# EAGLE design projeto-sd-rtc (EAGLE 5.12)
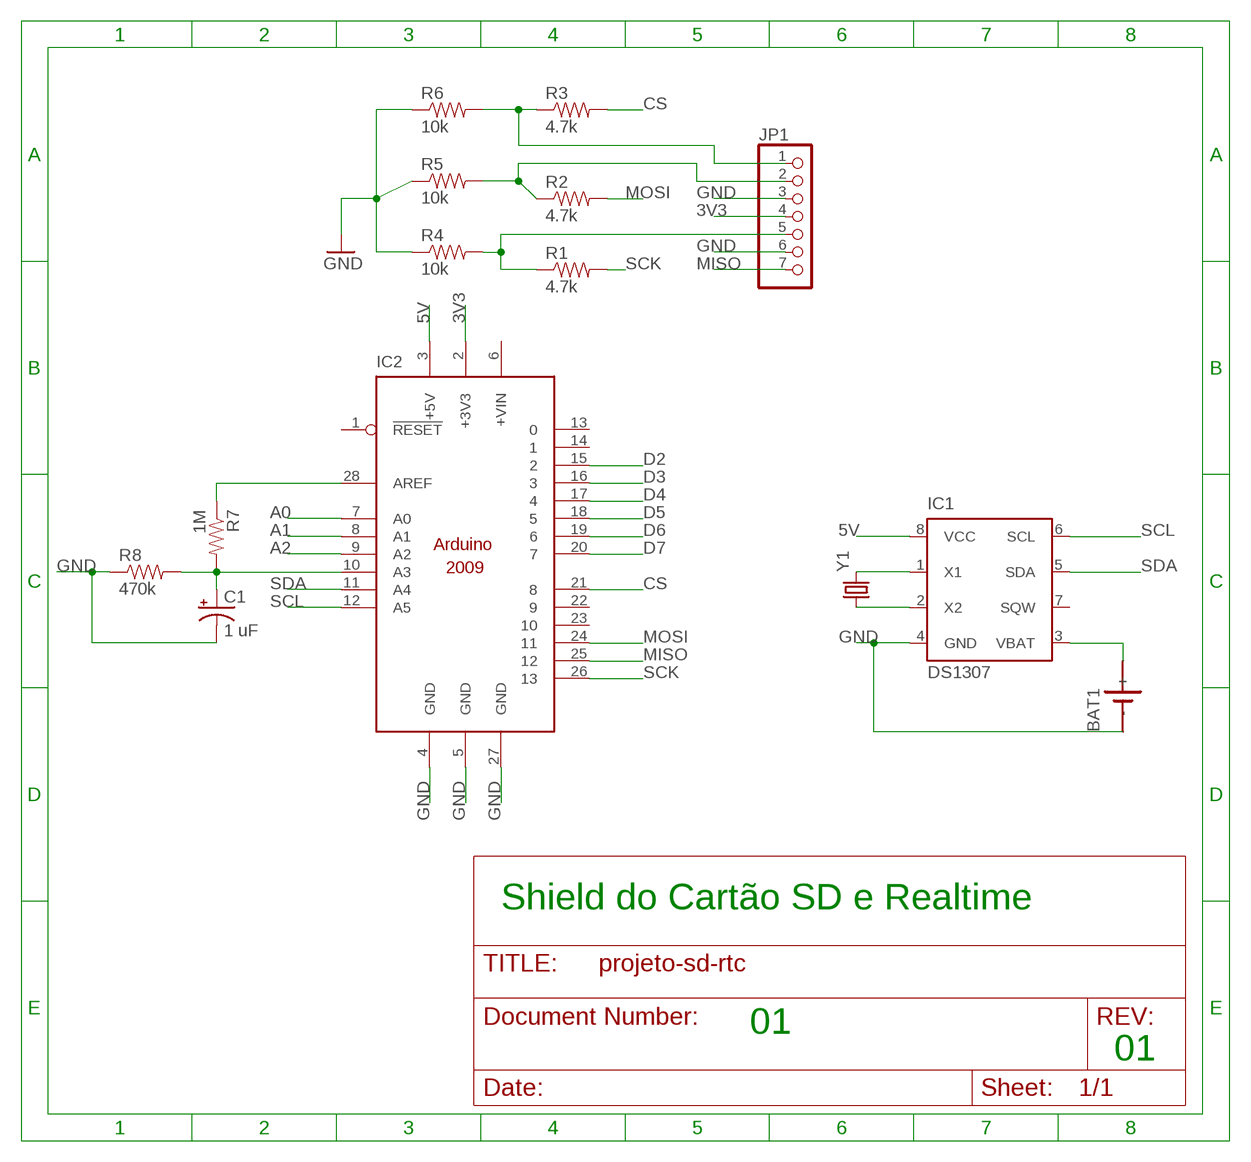
[diagram p0: schematic, sheet 1]

## Parts
BAT1  SN2032  [SN2032]
C1  1 uF  CAP_POLPTH2  [CPOL-RADIAL-10UF-25V]
IC1  DS1307  [DIL08]
IC2  ARDUINO2009_12  [ARDUINO2009_2]
JP1  PINHD-1X7/90  [1X07/90]
R1  4.7k  RESISTORPTH-1/4W  [AXIAL-0.4]
R2  4.7k  RESISTORPTH-1/4W  [AXIAL-0.4]
R3  4.7k  RESISTORPTH-1/4W  [AXIAL-0.4]
R4  10k  RESISTORPTH-1/4W  [AXIAL-0.4]
R5  10k  RESISTORPTH-1/4W  [AXIAL-0.4]
R6  10k  RESISTORPTH-1/4W  [AXIAL-0.4]
R7  1M  RESISTORPTH-1/4W  [AXIAL-0.4]
R8  470k  RESISTORPTH-1/4W  [AXIAL-0.4]
Y1  CRYSTALTC26H  [TC26H]

## Nets
3V3: IC2.2(+3V3) JP1.4
5V: IC1.8(VCC) IC2.3(+5V)
A0: IC2.7(A0)
A1: IC2.8(A1)
A2: IC2.9(A2)
AREF: IC2.28(AREF) R7.P$1
CCS: JP1.1 R3.P$1 R6.P$2
CMOSI: JP1.2 R2.P$1 R5.P$2
CS: IC2.21 R3.P$2
CSCK: JP1.5 R1.P$1 R4.P$2
D2: IC2.15
D3: IC2.16
D4: IC2.17
D5: IC2.18
D6: IC2.19
D7: IC2.20
GND: BAT1.- C1.2(-) IC1.4(GND) IC2.4(GND) IC2.5(GND) IC2.27(GND) JP1.3 JP1.6 R4.P$1 R5.P$1 R6.P$1 R8.P$1
MISO: IC2.25 JP1.7
MOSI: IC2.24 R2.P$2
N$1: IC1.1(X1) Y1.2
N$2: IC1.2(X2) Y1.1
N$5: BAT1.+ IC1.3(VBAT)
N$8: C1.1(+) IC2.10(A3) R7.P$2 R8.P$2
SCK: IC2.26 R1.P$2
SCL: IC1.6(SCL) IC2.12(A5)
SDA: IC1.5(SDA) IC2.11(A4)
Unconnected: IC1.7(SQW) IC2.1(!RESET) IC2.6(+VIN) IC2.13 IC2.14 IC2.22 IC2.23

## Notes on the sheet
- Shield do Cartão SD e Realtime
- 01
- 01

## Library data of the parts
BAT1 = sn2032:SN2032: LI BATTERY
C1 = SparkFun:CAP_POL: Capacitor Polarized These are standard SMD and PTH capacitors. Normally 10uF, 47uF, and 100uF in electrolytic and tantalum varieties. Always verify the external diameter of the through hole cap, it varies with capacity, voltage, and manufacturer. The EIA devices should be standard.
IC1 = ds1307_pcf8583:DS1307: I2C-Bus CLOCK/CALENDAR
IC2 = arduino:ARDUINO2009_1: The Arduino Duemilanove ("2009") is a microcontroller board based on the ATmega168 or ATmega328. - 14 digital input/output pins (of which 6 can be used as PWM outputs) - 6 analog inputs, a 16 MHz crystal oscillator - USB connection - power jack - ISP header - reset button It contains everything needed to support the microcontroller; simply connect it to a computer with a USB cable or power it with a AC-to-DC adapter or battery to get started http://arduino.cc/en/Main/ArduinoBoardDuemilanove
JP1 = pinhead:PINHD-1X7: PIN HEADER
R1-R8 = SparkFun:RESISTOR: Resistor Basic schematic elements and footprints for 0603, 1206, and PTH resistors.
Y1 = SparkFun:CRYSTAL: Crystals Various standard crystals. Proven footprints. Spark Fun Electronics SKU : COM-00534

## Board
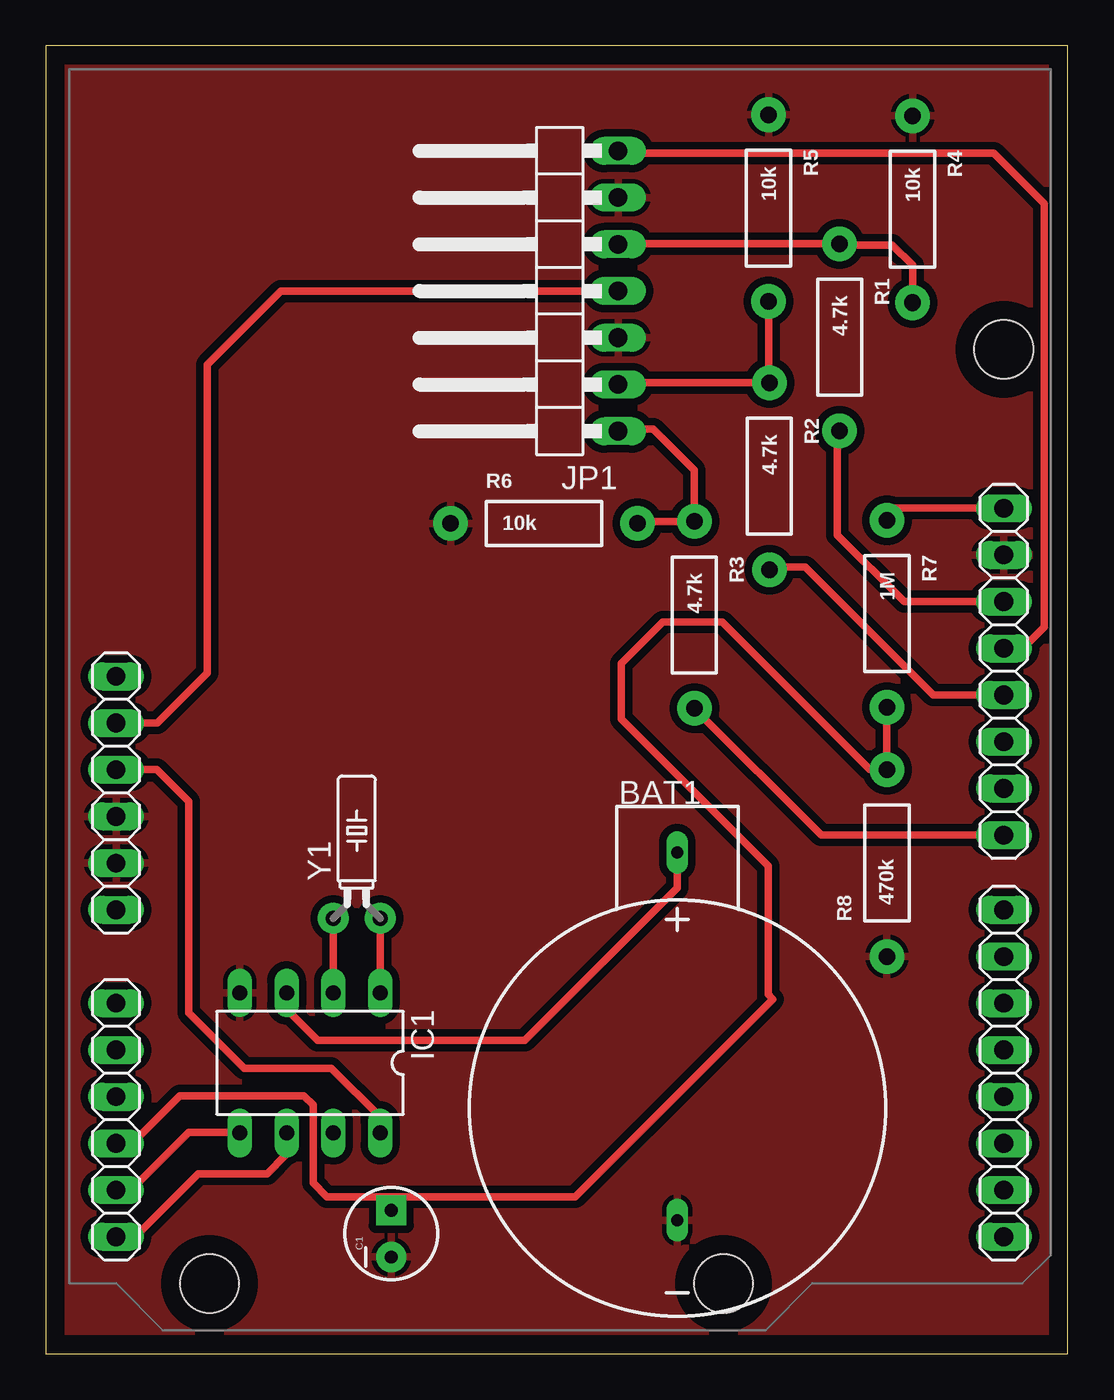
[diagram p1: board, top side]

Size 55.55 x 71.11 mm. Coordinates in mm from the lower left corner, seen from the top.
Outline: 0,0 55.55,0 55.55,71.11 0,71.11 0,0
Copper layers (1*16): Top 0.035mm / dielectric 1.5mm / Bottom 0.035mm
Design rules "default *": minimum track width 10mil, minimum drill 24mil, track to track 16mil, track to pad 16mil, pad to pad 16mil, via to via 16mil, smd to smd 16mil, copper to edge 40mil, drill to drill 8mil, minimum pad ring 10mil, minimum via ring 8mil, stop-mask expansion 4mil, vias tented up to drill 0mil, thermal gap 10mil

### Footprints (pad centres in the part's own frame; a part is rotated, then mirrored left to right if it is on the bottom)
SN2032 = drill 0.65 long: + 0,13.9; - 0,-6.1
CPOL-RADIAL-10UF-25V = drill 0.7 pad 1.651 square: 1 1.27,0 | drill 0.7 pad 1.651 round: 2 -1.27,0
DIL08 = drill 0.813 long: 1 -3.81,-3.81; 2 -1.27,-3.81; 3 1.27,-3.81; 4 3.81,-3.81; 5 3.81,3.81; 6 1.27,3.81; 7 -1.27,3.81; 8 -3.81,3.81
ARDUINO2009_2 = drill 1.016 long: 1 33.02,2.54; 2 35.56,2.54; 3 38.1,2.54; 4 40.64,2.54; 5 43.18,2.54; 6 45.72,2.54; 7 50.8,2.54; 8 53.34,2.54; 9 55.88,2.54; 10 58.42,2.54; 11 60.96,2.54; 12 63.5,2.54; 13 63.5,50.8; 14 60.96,50.8; 15 58.42,50.8; 16 55.88,50.8; 17 53.34,50.8; 18 50.8,50.8; 19 48.26,50.8; 20 45.72,50.8; 21 41.656,50.8; 22 39.116,50.8; 23 36.576,50.8; 24 34.036,50.8; 25 31.496,50.8; 26 28.956,50.8; 27 26.416,50.8; 28 23.876,50.8 | hole 3.2: 15.24,50.8; 66.04,35.56; 66.04,7.62
1X07/90 = drill 1.016 long: 1 -7.62,-3.81; 2 -5.08,-3.81; 3 -2.54,-3.81; 4 0,-3.81; 5 2.54,-3.81; 6 5.08,-3.81; 7 7.62,-3.81
AXIAL-0.4 = drill 0.9 pad 1.88 round: P$1 -5.08,0; P$2 5.08,0
TC26H = drill 0.813 pad 1.676 round: 1 -1.27,0; 2 1.27,0

### Placement (x,y rotation side)
BAT1  34.33,13.36 0 top
C1  18.77,6.52 90 top
IC1  14.36,15.8 180 top
IC2  1.27,69.85 270 top
JP1  27.29,57.79 90 top
R1  43.15,55.27 270 top
R2  39.33,47.71 270 top
R3  35.25,40.17 270 top
R4  47.11,62.23 270 top
R5  39.28,62.29 270 top
R6  27.07,45.14 0 top
R7  45.72,40.24 270 top
R8  45.72,26.67 90 top
Y1  16.89,23.68 0 top

### Tracks (layer width: path | path; a pad name or v marks a point on that pad's centre or on a via)
3V3
  Top 0.406: IC2.2 6.04,34.29 8.77,37.02 8.77,53.77 12.77,57.77 31.09,57.77 JP1.4
5V
  Top 0.406: IC1.8 18.16,12.88 15.52,15.52 10.77,15.52 7.77,18.52 7.77,30.02 6.02,31.77 3.83,31.77 IC2.3
AREF
  Top 0.406: IC2.28 45.81,45.97 R7.P$1
CCS
  Top 0.406: R6.P$2 32.27,45.25 R3.P$1 35.25,48.04 33.02,50.27 31.2,50.27 JP1.1
CMOSI
  Top 0.406: R5.P$2 39.28,52.84 R2.P$1 31.18,52.79 JP1.2
CS
  Top 0.406: IC2.21 42.15,28.19 R3.P$2
CSCK
  Top 0.406: R1.P$1 31.12,60.35 JP1.5 | R1.P$1 42.19,60.35 | R4.P$2 47.11,59.18 46.02,60.27 43.23,60.27 R1.P$1
GND
  pour Top: 0,0 0,71.12 55.88,71.12 55.88,0
MISO
  Top 0.406: IC2.25 53.1,38.35 54.27,39.52 54.27,62.52 51.52,65.27 31.23,65.27 JP1.7
MOSI
  Top 0.406: IC2.24 48.23,35.81 41.27,42.77 39.47,42.77 R2.P$2
N$1
  Top 0.406: IC1.1 Y1.2
N$2
  Top 0.406: IC1.2 Y1.1
N$5
  Top 0.406: BAT1.+ 34.33,25.32 26.02,17.02 14.77,17.02 13.27,18.52 13.27,19.43 IC1.3
N$8
  Top 0.406: R7.P$2 R8.P$2 44.79,31.75 36.77,39.77 33.52,39.77 31.27,37.52 31.27,34.52 39.27,26.52 39.27,19.52 39.52,19.27 28.77,8.52 18.77,8.52 | 18.77,8.52 15.27,8.52 14.52,9.27 14.52,13.52 14.02,14.02 7.27,14.02 4.68,11.43 IC2.10 | 18.77,8.52 C1.1
SCK
  Top 0.406: IC2.26 46.65,40.89 43.02,44.52 43.02,50.06 R1.P$2
SCL
  Top 0.406: IC2.12 4.85,6.35 8.27,9.77 12.02,9.77 13.02,10.77 13.02,11.93 IC1.6
SDA
  Top 0.406: IC2.11 4.64,8.89 7.77,12.02 10.52,12.02 IC1.5